# EAGLE board controller_V1 (EAGLE 9.6.2), part 1 of 2
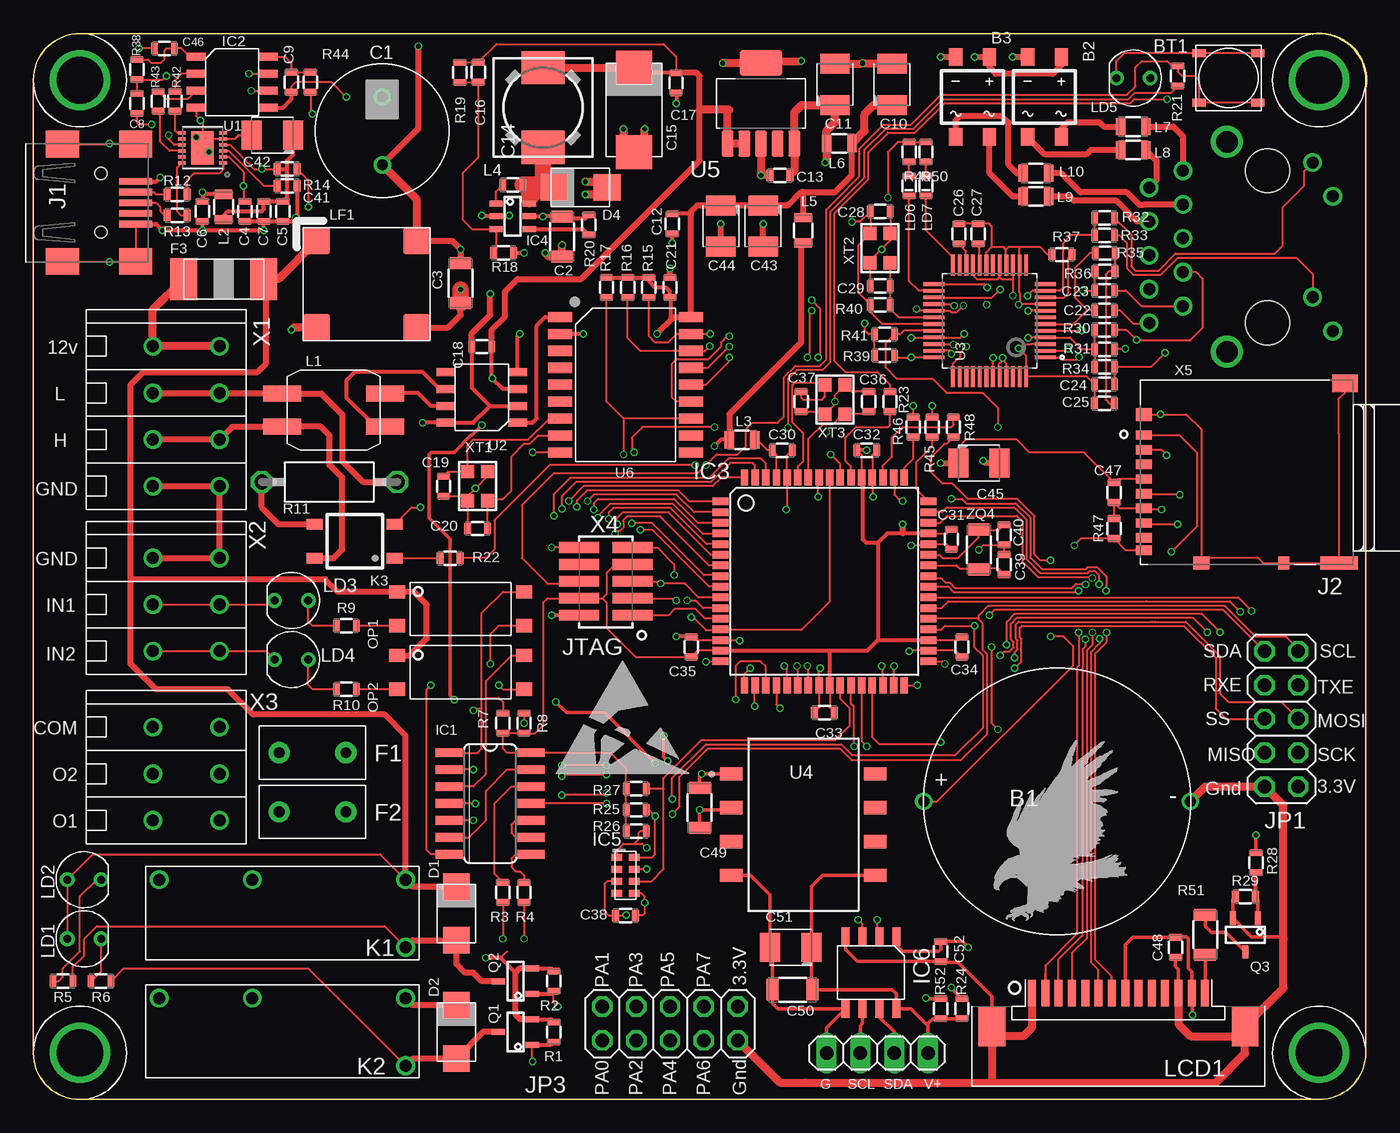
[diagram p2: board, top side]
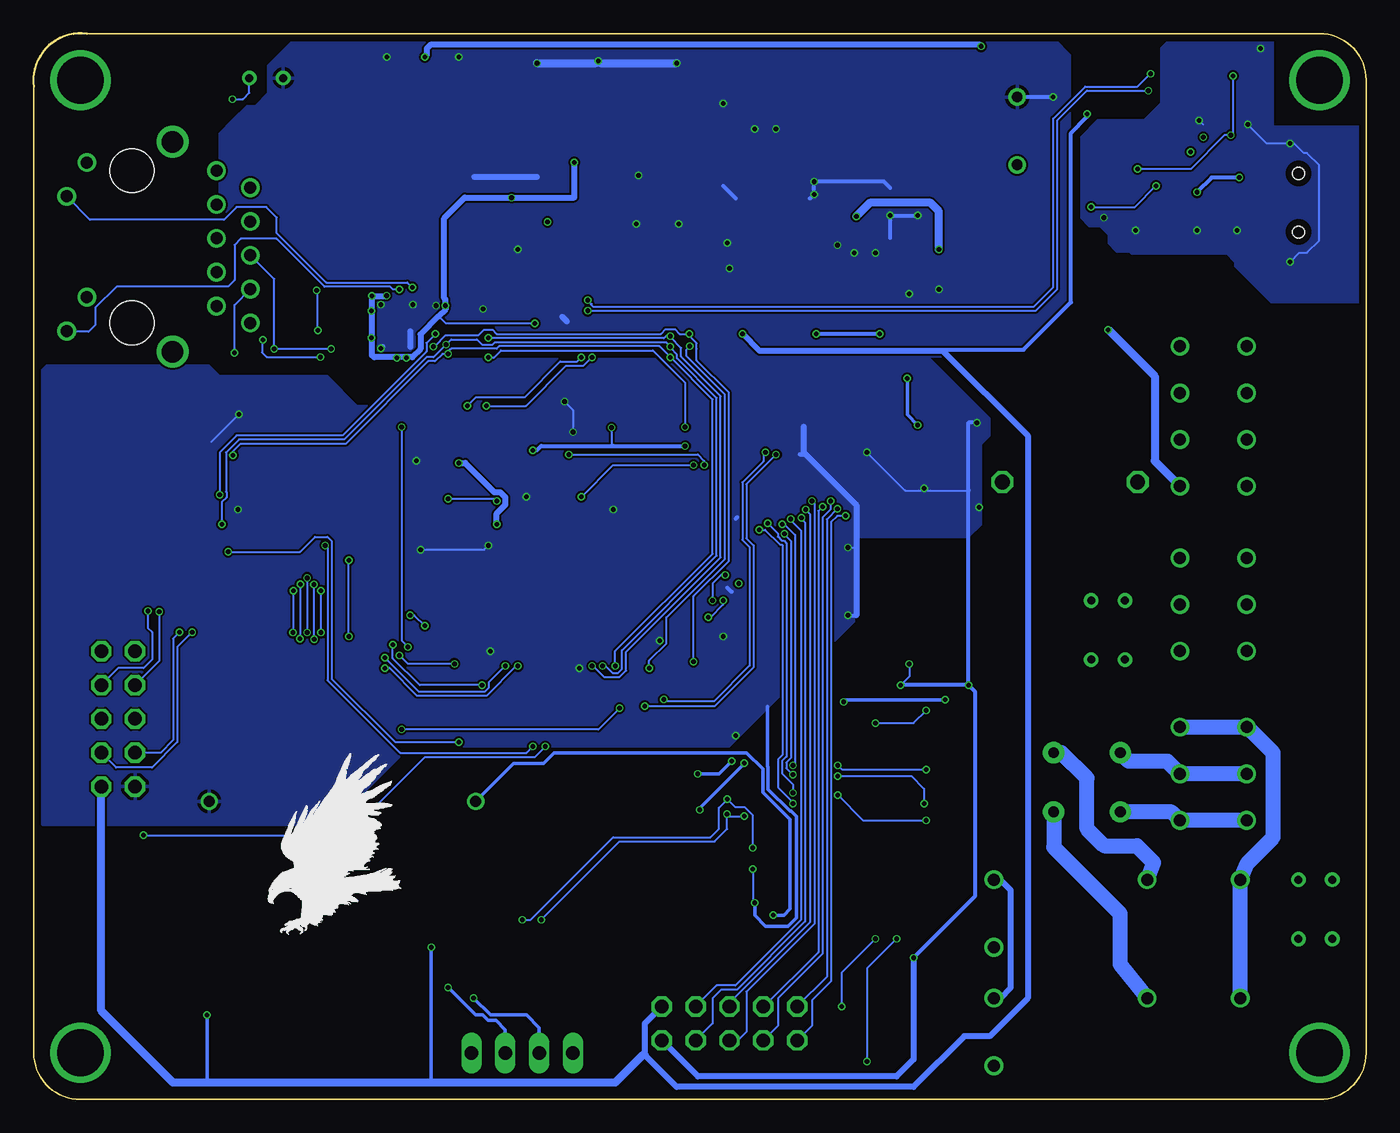
[diagram p3: board, bottom side, seen from below]

Size 100.03 x 80.02 mm. Coordinates in mm from the lower left corner, seen from the top.
Outline: 96,79.99 arc-106 100,75.99
Copper layers (1*16): Top 0.035mm / dielectric 1.5mm / Bottom 0.035mm
Design rules "default *": minimum track width 6mil, minimum drill 0.3mm, track to track 6mil, track to pad 6mil, pad to pad 6mil, via to via 6mil, smd to smd 6mil, copper to edge 20mil, drill to drill 6mil, minimum pad ring 10mil, minimum via ring 0.1mm, stop-mask expansion 4mil, vias tented up to drill 0.5mm, thermal gap 10mil

## Footprints (pad centres in the part's own frame; a part is rotated, then mirrored left to right if it is on the bottom)
CR2032_DIP = drill 0.8: P$1 -10,0; P$2 10,0
MBS = smd 1 x 1.3: + -1.27,-3; - 1.27,-3; AC1 -1.27,3; AC2 1.27,3
5X5MM_SMD_CY = smd 1 x 0.6: P$1 -2.2,1.85; P$2 -2.2,-1.85; P$3 2.2,-1.85; P$4 2.2,1.85
5.08MM = drill 0.8: P$1 -2.54,0; P$2 2.54,0
1206 = smd 1.6 x 0.9: 1 0,1.5; 2 0,-1.5
0603 = smd 0.85 x 0.5: 1 0,0.75; 2 0,-0.75
KA-3528ASYC = smd 1.5 x 2.2: M -1.55,0; P 1.55,0
D/7343-31R = smd 2.55 x 2.7: + 3.175,0; - -3.175,0
SMA403D = smd 2 x 2: P$1 -2,0; P$2 2,0
FUSE_DIP_2.5A250V = drill 0.8 pad 1.6: P$1 -2.5,0; P$2 2.5,0
SMD_2410_FUSE_NOK = smd 2 x 3.15: P$1 -3,0; P$2 3,0
SO14 = smd 0.66 x 2.032: 1 -3.81,-3.073; 2 -2.54,-3.073; 3 -1.27,-3.073; 4 0,-3.073; 5 1.27,-3.073; 6 2.54,-3.073; 7 3.81,-3.073; 8 3.81,3.073; 9 2.54,3.073; 10 1.27,3.073; 11 0,3.073; 12 -1.27,3.073; 13 -2.54,3.073; 14 -3.81,3.073
SO8 = smd 0.6 x 1.4: 1 -1.905,-2.7; 2 -0.635,-2.7; 3 0.635,-2.7; 4 1.905,-2.7; 5 1.905,2.7; 6 0.635,2.7; 7 -0.635,2.7; 8 -1.905,2.7
TQFP64 = smd 1.194 x 0.559: 1 -7.8,6; 2 -7.8,5.2; 3 -7.8,4.4; 4 -7.8,3.6; 5 -7.8,2.8; 6 -7.8,2; 7 -7.8,1.2; 8 -7.8,0.4; 9 -7.8,-0.4; 10 -7.8,-1.2; 11 -7.8,-2; 12 -7.8,-2.8; 13 -7.8,-3.6; 14 -7.8,-4.4; 15 -7.8,-5.2; 16 -7.8,-6; 33 7.8,-6; 34 7.8,-5.2; 35 7.8,-4.4; 36 7.8,-3.6; 37 7.8,-2.8; 38 7.8,-2; 39 7.8,-1.2; 40 7.8,-0.4; 41 7.8,0.4; 42 7.8,1.2; 43 7.8,2; 44 7.8,2.8; 45 7.8,3.6; 46 7.8,4.4; 47 7.8,5.2; 48 7.8,6 | smd 0.559 x 1.194: 17 -6,-7.8; 18 -5.2,-7.8; 19 -4.4,-7.8; 20 -3.6,-7.8; 21 -2.8,-7.8; 22 -2,-7.8; 23 -1.2,-7.8; 24 -0.4,-7.8; 25 0.4,-7.8; 26 1.2,-7.8; 27 2,-7.8; 28 2.8,-7.8; 29 3.6,-7.8; 30 4.4,-7.8; 31 5.2,-7.8; 32 6,-7.8; 49 6,7.8; 50 5.2,7.8; 51 4.4,7.8; 52 3.6,7.8; 53 2.8,7.8; 54 2,7.8; 55 1.2,7.8; 56 0.4,7.8; 57 -0.4,7.8; 58 -1.2,7.8; 59 -2,7.8; 60 -2.8,7.8; 61 -3.6,7.8; 62 -4.4,7.8; 63 -5.2,7.8; 64 -6,7.8
SOT-23(6) = smd 0.45 x 1: 1 -0.95,-1.25; 2 0,-1.25; 3 0.95,-1.25; 4 0.95,1.25; 5 0,1.25; 6 -0.95,1.25
C7_RTC = smd 0.8 x 0.5: 1 -0.65,1.35; 2 -0.65,0.45; 3 -0.65,-0.45; 4 -0.65,-1.35; 5 0.65,-1.35; 6 0.65,-0.45; 7 0.65,0.45; 8 0.65,1.35
65100516121 = smd 0.5 x 2.5: 1 -1.6,2.6; 2 -0.8,2.6; 3 0,2.6; 4 0.8,2.6; 5 1.6,2.6 | smd 2 x 2.5: Z1 -4.4,2.6; Z2 4.4,2.6; Z3 4.4,-2.9; Z4 -4.4,-2.9 | hole 0.9: -2.2,0; 2.2,0
HRS_DM3AT-SF-PEJM5 = smd 0.7 x 1.2: 1 3.2,0; 2 2.1,0; 3 1,0; 4 -0.1,0; 5 -1.2,0; 6 -2.3,0; 7 -3.4,0; 8 -4.5,0; SWB -5.45,0 | smd 1 x 1.2: P1 -6.4,-4.3; P4 4.75,0 | smd 1 x 2.8: P2 -6.4,-14.65 | smd 1.3 x 1.9: P3 7.1,-15.1 | smd 1 x 0.8: SWA -6.4,-10.5
2X05 = drill 1.016 octagon: 1 -5.08,-1.27; 2 -5.08,1.27; 3 -2.54,-1.27; 4 -2.54,1.27; 5 0,-1.27; 6 0,1.27; 7 2.54,-1.27; 8 2.54,1.27; 9 5.08,-1.27; 10 5.08,1.27
1X04 = drill 1.016 long: 1 -3.81,0; 2 -1.27,0; 3 1.27,0; 4 3.81,0
12-H1(610)_DIP = drill 0.9: COM 0,-11.5; NO 0,-18.5; V1 0,0; V2 5.08,0
SOP04 = smd 0.8 x 1.2: 1 -1.27,-3; 2 1.27,-3; 3 1.27,3; 4 -1.27,3
EPCOS_FILTER = smd 2.85 x 1.2: P$1 -3.85,1.25; P$2 -3.85,-1.25; P$3 3.85,1.25; P$4 3.85,-1.25
0805 = smd 1.3 x 0.7: 1 0,0.95; 2 0,-0.95
DR74 = smd 2.5 x 3.25: 1 -3,0; 2 3,0
ALE_LCD_14PIN_CONNECTOR = smd 0.6 x 2: 1 6.5,-1; 2 5.5,-1; 3 4.5,-1; 4 3.5,-1; 5 2.5,-1; 6 1.5,-1; 7 0.5,-1; 8 -0.5,-1; 9 -1.5,-1; 10 -2.5,-1; 11 -3.5,-1; 12 -4.5,-1; 13 -5.5,-1; 14 -6.5,-1 | smd 2 x 3: M1 9.5,1.5; M2 -9.5,1.5
3MM_DIP_LED = drill 0.6: A 1.27,0; K -1.27,0
0603_P = smd 0.85 x 0.5: 1 0,0.75; 2 0,-0.75
POWERFILTER = smd 2 x 2: P1IN -3.5,3.5; P1OUT 4,3.5; P2IN -3.5,-3; P2OUT 4,-3
HV_OPTOCOUPLER_L133 = smd 1 x 1.2: ANODE 1.27,4.75; C 1.27,-4.75; CATHODE -1.27,4.75; E -1.27,-4.75
SOT-23(3) = smd 0.45 x 1: 1 -0.95,-1.25; 2 0.95,-1.25; 3 0,1.29
VMTA55 = drill 1.1 octagon: 1 -5.08,0; 2 5.08,0
IC_FT234XD-R = smd 0.65 x 0.25: 1 -1.55,1.125; 2 -1.55,0.675; 3 -1.55,0.225; 4 -1.55,-0.225; 5 -1.55,-0.675; 6 -1.55,-1.125; 7 1.55,-1.125; 8 1.55,-0.675; 9 1.55,-0.225; 10 1.55,0.225; 11 1.55,0.675; 12 1.55,1.125 | smd 1.7 x 2.5: 13 0,0
QFP50P900X900X160-48N = smd 1.56 x 0.28: 1 -4.18,2.75; 2 -4.18,2.25; 3 -4.18,1.75; 4 -4.18,1.25; 5 -4.18,0.75; 6 -4.18,0.25; 7 -4.18,-0.25; 8 -4.18,-0.75; 9 -4.18,-1.25; 10 -4.18,-1.75; 11 -4.18,-2.25; 12 -4.18,-2.75; 25 4.18,-2.75; 26 4.18,-2.25; 27 4.18,-1.75; 28 4.18,-1.25; 29 4.18,-0.75; 30 4.18,-0.25; 31 4.18,0.25; 32 4.18,0.75; 33 4.18,1.25; 34 4.18,1.75; 35 4.18,2.25; 36 4.18,2.75 | smd 0.28 x 1.56: 13 -2.75,-4.18; 14 -2.25,-4.18; 15 -1.75,-4.18; 16 -1.25,-4.18; 17 -0.75,-4.18; 18 -0.25,-4.18; 19 0.25,-4.18; 20 0.75,-4.18; 21 1.25,-4.18; 22 1.75,-4.18; 23 2.25,-4.18; 24 2.75,-4.18; 37 2.75,4.18; 38 2.25,4.18; 39 1.75,4.18; 40 1.25,4.18; 41 0.75,4.18; 42 0.25,4.18; 43 -0.25,4.18; 44 -0.75,4.18; 45 -1.25,4.18; 46 -1.75,4.18; 47 -2.25,4.18; 48 -2.75,4.18
TRACOPOWER_TSM_0505S_0 = smd 1 x 1.7: 1 -3.81,-5.4; 3 -1.27,-5.4; 5 1.27,-5.4; 7 3.81,-5.4; 8 3.81,5.4; 10 1.27,5.4; 12 -1.27,5.4; 14 -3.81,5.4
SOT230P700X180-4N = smd 1.97 x 0.89: 1 -3.025,2.5; 2 -3.025,1.25; 3 -3.025,0; 4 -3.025,-1.25; 5 -3.025,-2.5 | smd 1.97 x 3.19: HEATSINK 3.025,0
SO18L = smd 0.762 x 1.778: 1 -5.08,-4.915; 2 -3.81,-4.915; 3 -2.54,-4.915; 4 -1.27,-4.915; 5 0,-4.915; 6 1.27,-4.915; 7 2.54,-4.915; 8 3.81,-4.915; 9 5.08,-4.915; 10 5.08,4.915; 11 3.81,4.915; 12 2.54,4.915; 13 1.27,4.915; 14 0,4.915; 15 -1.27,4.915; 16 -2.54,4.915; 17 -3.81,4.915; 18 -5.08,4.915
80X100_PCB_FRAME = drill 3.5: SC1 3.5,96.5; SC2 76.5,96.5; SC3 3.5,3.5; SC4 76.5,3.5
WAGO250_FP_4X = drill 0.9: P$1 0,5; P$2 3.5,5; P$3 7,5; P$4 10.5,5; U$1 0,0; U$2 3.5,0; U$3 7,0; U$4 10.5,0
WAGO250_FP_3X = drill 0.9: P$1 0,5; P$2 3.5,5; P$3 7,5; U$1 0,0; U$2 3.5,0; U$3 7,0
MINI10P_SPI/JTAG/PDI = smd 0.8 x 3: 1 0,-4; 2 0,0; 3 1.27,-4; 4 1.27,0; 5 2.54,-4; 6 2.54,0; 7 3.81,-4; 8 3.81,0; 9 5.08,-4; 10 5.08,0
RB1-125BHQ1A = drill 0.9: L1 6.325,-3.38; L2 3.784,-4.899; L3 -3.786,-3.379; L4 -6.325,-4.9 | drill 0.9 pad 1.3: R1 -5.716,8.889; R2 -4.446,6.349; R3 -3.176,8.889; R4 -1.906,6.349; R5 -0.636,8.889; R6 0.634,6.349; R7 1.904,8.889; R8 3.174,6.349; R9 4.444,8.889; R10 5.714,6.349 | drill 1.6 pad 2.184: S1 -7.876,3.049; S2 7.874,3.049 | hole 3.3: 5.714,-0.001; -5.716,-0.001
QUARTZ_3X3MM = smd 1 x 1: 1 -0.75,1.1; 2 0.75,1.1; 3 0.75,-1.1; 4 -0.75,-1.1

## Placement (x,y rotation side)
B1  BAT_CR2032_DIP  [CR2032_DIP]  76.83,22.37 0 top
B2  B1S  [MBS]  75.88,75.24 180 top
B3  B1S  [MBS]  70.48,75.24 180 top
BT1  RESET  [5X5MM_SMD_CY]  89.69,76.67 0 top
C1  47uf  [5.08MM]  26.19,72.7 270 top
C2  0.1uF  [1206]  39.69,64.76 0 top
C3  0.1uF  [1206]  32.07,61.27 0 top
C4  SMD_C0603  [0603]  15.88,66.66 0 top
C5  SMD_C0603  [0603]  18.73,66.66 0 top
C6  SMD_C0603  [0603]  12.7,66.66 0 top
C7  SMD_C0603  [0603]  17.3,66.66 0 top
C8  0.1uF  [0603]  7.78,74.76 0 top
C9  SMD_C0603  [0603]  19.37,76.35 0 top
C10  TANTAL_150UF_3528  [KA-3528ASYC]  64.45,76.19 270 top
C11  TANTAL_150UF_3528  [KA-3528ASYC]  60.17,76.19 270 top
C12  SMD_C0603  [0603]  47.94,65.71 0 top
C13  SMD_C0603  [0603]  56.04,69.36 270 top
C14  0.01uF  [0603]  35.98,68.64 90 top
C15  6.3V/100uf  [D/7343-31R]  45.09,74.28 90 top
C16  0.01uF  [0603]  33.39,77.1 180 top
C17  0.1uF  [0603]  48.24,76.31 180 top
C18  0.1uF  [0603]  33.66,56.5 90 top
C19  16pf  [0603]  30.8,46.03 0 top
C20  16pf  [0603]  33.34,42.85 270 top
C21  0.1uF  [0603]  47.78,60.95 180 top
C22  SMD_C0603  [0603]  80.39,59.24 90 top
C23  SMD_C0603  [0603]  80.39,60.71 90 top
C24  0.1uf  [0603]  80.39,53.68 90 top
C25  10nf  [0603]  80.38,52.24 90 top
C26  SMD_C0603  [0603]  69.47,64.97 0 top
C27  SMD_C0603  [0603]  70.91,64.97 0 top
C28  SMD_C0603  [0603]  63.57,66.65 270 top
C29  SMD_C0603  [0603]  63.57,61.05 90 top
C30  0.1uF  [0603]  56.2,48.73 90 top
C31  0.1uF  [0603]  68.9,42.06 0 top
C32  0.1uF  [0603]  62.55,48.73 90 top
C33  0.1uF  [0603]  59.37,29.04 270 top
C34  0.1uF  [0603]  69.69,33.96 0 top
C35  0.1uF  [0603]  49.37,33.96 180 top
C36  10p  [0603]  62.71,52.38 180 top
C37  10p  [0603]  57.63,52.38 0 top
C38  SMD_C0603  [0603]  44.45,13.8 90 top
C39  SMD_C0603  [0603]  72.87,40.15 180 top
C40  SMD_C0603  [0603]  72.87,42.38 0 top
C41  SMD_C0603  [0603]  19.05,68.57 90 top
C42  TANTAL_150UF_3528  [KA-3528ASYC]  17.94,72.38 0 top
C43  TANTAL_150UF_3528  [KA-3528ASYC]  54.77,65.55 90 top
C44  TANTAL_150UF_3528  [KA-3528ASYC]  51.59,65.55 90 top
C45  TANTAL_150UF_3528  [KA-3528ASYC]  70.96,47.77 180 top
C46  0.1uF  [0603]  9.84,78.89 270 top
C47  SMD_C0603  [0603]  81.12,45.55 180 top
C48  SMD_C0603  [0603]  85.72,11.42 180 top
C49  SMD_C1206  [1206]  50.01,21.9 180 top
C50  SMD_C1206  [1206]  56.99,8.24 270 top
C51  TANTAL_150UF_3528  [KA-3528ASYC]  56.83,11.42 0 top
C52  SMD_C0603  [0603]  68.1,11.1 0 top
D1  [SMA403D]  31.75,13.96 270 top
D2  [SMA403D]  31.75,5.07 270 top
D4  RB060m  [SMA403D]  41.05,68.46 0 top
F1  1.125A  [FUSE_DIP_2.5A250V]  20.95,26.02 0 top
F2  1.125A  [FUSE_DIP_2.5A250V]  20.95,21.58 0 top
F3  250mA  [SMD_2410_FUSE_NOK]  14.29,61.58 0 top
IC1  74AC14D  [SO14]  34.29,22.21 270 top
IC2  SI8421AB_SO8  [SO8]  14.92,76.35 270 top
IC3  AXTMEGA256A3BU  [TQFP64]  59.37,38.88 0 top
IC4  BD9G101G  [SOT-23(6)]  35.97,66.29 270 top
IC5  RTC_RV-8803-C7  [C7_RTC]  44.45,16.82 0 top
IC6  SI8420AB_SO8  [SO8]  62.87,9.51 180 top
J1  [65100516121]  5.08,67.3 270 top
J2  DM3AT-SF-PEJM5  [HRS_DM3AT-SF-PEJM5]  83.34,46.66 90 top
JP1  [2X05]  93.66,28.56 270 top
JP2  [1X04]  63.34,3.48 180 top
JP3  [2X05]  47.78,5.7 0 top
K1  12-H1(610)  [12-H1(610)_DIP]  27.94,16.5 270 top
K2  12-H1(610)  [12-H1(610)_DIP]  27.94,7.61 270 top
K3  TLP4176G  [SOP04]  24.13,41.9 90 top
L1  EPCOS_B82793_FILTER  [EPCOS_FILTER]  22.54,51.74 0 top
L2  SMD_L  [0805]  14.29,66.98 0 top
L3  SMD_L  [0805]  53.18,49.52 90 top
L4  10uF  [DR74]  38.26,74.44 90 top
L5  SMD_L  [0805]  57.78,65.24 180 top
L6  SMD_L  [0805]  60.48,71.74 90 top
L7  SMD_L  [0805]  82.55,73.02 90 top
L8  SMD_L  [0805]  82.55,71.27 90 top
L9  SMD_L  [0805]  75.25,67.78 90 top
L10  SMD_L  [0805]  75.25,69.52 90 top
LCD1  ALE_LCD_128X64  [ALE_LCD_14PIN_CONNECTOR]  81.44,6.97 180 top
LD1  G_LEd  [3MM_DIP_LED]  3.81,12.05 180 top
LD2  G_LED  [3MM_DIP_LED]  3.81,16.5 180 top
LD3  G_LEd  [3MM_DIP_LED]  19.37,37.45 0 top
LD4  G_LEd  [3MM_DIP_LED]  19.37,33.01 0 top
LD5  LED  [3MM_DIP_LED]  82.55,76.67 0 top
LD6  LED0603  [0603_P]  65.72,68.57 180 top
LD7  LED0603  [0603_P]  66.99,68.57 180 top
LF1  POWERFILTER501_EMERALD  [POWERFILTER]  24.77,60.95 0 top
OP1  L133_HV_OPTOCOUPLER  [HV_OPTOCOUPLER_L133]  32.07,36.82 90 top
OP2  L133_HV_OPTOCOUPLER  [HV_OPTOCOUPLER_L133]  32.07,32.06 90 top
Q1  BSS123SOT-23-3  [SOT-23(3)]  36.2,5.07 90 top
Q2  BSS123SOT-23-3  [SOT-23(3)]  36.2,8.88 90 top
Q3  BSS123SOT-23-3  [SOT-23(3)]  90.96,12.37 180 top
R1  10K  [0603]  39.05,5.07 180 top
R2  10K  [0603]  39.05,8.88 180 top
R3  1K  [0603]  35.24,15.55 0 top
R4  1K  [0603]  36.83,15.55 0 top
R5  4.7K  [0603]  2.22,8.88 90 top
R6  4.7K  [0603]  5.08,8.88 90 top
R7  10K  [0603]  35.24,28.25 0 top
R8  10K  [0603]  36.83,28.25 0 top
R9  4.7K  [0603]  23.5,35.55 90 top
R10  4.7K  [0603]  23.5,30.79 90 top
R11  120R  [VMTA55]  22.23,46.34 0 top
R12  SMD_R0603  [0603]  10.79,67.93 90 top
R13  SMD_R0603  [0603]  10.79,66.35 90 top
R14  SMD_R0603  [0603]  19.05,69.84 90 top
R15  10K  [0603]  46.2,60.95 180 top
R16  10K  [0603]  44.61,60.95 180 top
R17  10K  [0603]  43.02,60.95 180 top
R18  6.2K  [0603]  35.3,63.55 270 top
R19  36K  [0603]  32.01,77.09 0 top
R20  4.7K  [0603]  41.69,65.64 0 top
R21  10K  [0603]  85.88,76.82 0 top
R22  470R  [0603]  31.27,40.63 90 top
R23  470R  [0603]  64.29,52.38 180 top
R24  SMD_R0603  [0603]  69.69,6.82 0 top
R25  SMD_R0603  [0603]  45.24,21.74 270 top
R26  SMD_R0603  [0603]  45.24,20.15 270 top
R27  SMD_R0603  [0603]  45.24,23.33 270 top
R28  SMD_R0603  [0603]  91.76,17.77 0 top
R29  SMD_R0603  [0603]  90.96,15.23 90 top
R30  SMD_R0603  [0603]  80.39,57.76 270 top
R31  SMD_R0603  [0603]  80.41,56.31 270 top
R32  SMD_R0603  [0603]  80.39,66.16 270 top
R33  SMD_R0603  [0603]  80.39,64.86 270 top
R34  SMD_R0603  [0603]  80.41,54.99 270 top
R35  SMD_R0603  [0603]  80.43,63.53 270 top
R36  SMD_R0603  [0603]  80.42,62.14 270 top
R37  SMD_R0603  [0603]  77.19,63.42 90 top
R38  R62  [0603]  7.78,77.3 180 top
R39  SMD_R0603  [0603]  63.89,55.84 270 top
R40  SMD_R0603  [0603]  63.57,59.65 90 top
R41  SMD_R0603  [0603]  63.89,57.44 270 top
R42  R62  [0603]  10.64,74.92 180 top
R43  R62  [0603]  9.37,74.92 180 top
R44  R62  [0603]  20.8,76.35 0 top
R45  R62  [0603]  67.47,50.47 0 top
R46  R62  [0603]  66.04,50.47 0 top
R47  SMD_R0603  [0603]  81.12,42.85 180 top
R48  SMD_R0603  [0603]  69.06,50.47 0 top
R49  SMD_R0603  [0603]  65.72,71.11 180 top
R50  SMD_R0603  [0603]  66.99,71.11 180 top
R51  SMD_R1206  [1206]  87.95,12.37 0 top
R52  SMD_R0603  [0603]  68.1,6.82 0 top
U1  FT234XD-R  [IC_FT234XD-R]  12.7,71.43 180 top
U2  MCP2551-SOIC8  [SO8]  33.66,52.69 90 top
U3  W5500  [QFP50P900X900X160-48N]  71.77,58.45 180 top
U4  TRACOPOWER_TSM_0505STRACOPOWER_TSM_0505S_0_0  [TRACOPOWER_TSM_0505S_0]  57.78,20.63 270 top
U5  MCP1825S-3302E/DB  [SOT230P700X180-4N]  54.61,74.76 90 top
U6  MCP2515-SOIC18  [SO18L]  44.45,53.65 270 top
U$1  JLC_PCB_FRAME  [80X100_PCB_FRAME]  0,80 270 top
U$2  [EAGLE-PLC-10MM]  72.1,13.39 0 top
U$3  [ESD_10.00]  39.12,24.34 0 top
U$4  [EAGLE-PLC-10MM]  82.4,12.39 0 bottom
X1  WAGO250_X4  [WAGO250_FP_4X]  13.97,46.03 90 top
X2  WAGO250_X3  [WAGO250_FP_3X]  13.97,33.64 90 top
X3  WAGO250_X3  [WAGO250_FP_3X]  13.97,20.94 90 top
X4  ATMEL_ICE_CONNECTOR  [MINI10P_SPI/JTAG/PDI]  40.96,36.34 90 top
X5  RB1-125BHQ1A  [RB1-125BHQ1A]  92.63,64 90 top
XT1  16MHz  [QUARTZ_3X3MM]  33.34,46.03 0 top
XT2  QUARTZ_ZQ  [QUARTZ_3X3MM]  63.54,63.9 180 top
XT3  32MHz  [QUARTZ_3X3MM]  60.17,52.54 180 top
ZQ4  32khz  [1206]  70.96,41.26 180 top